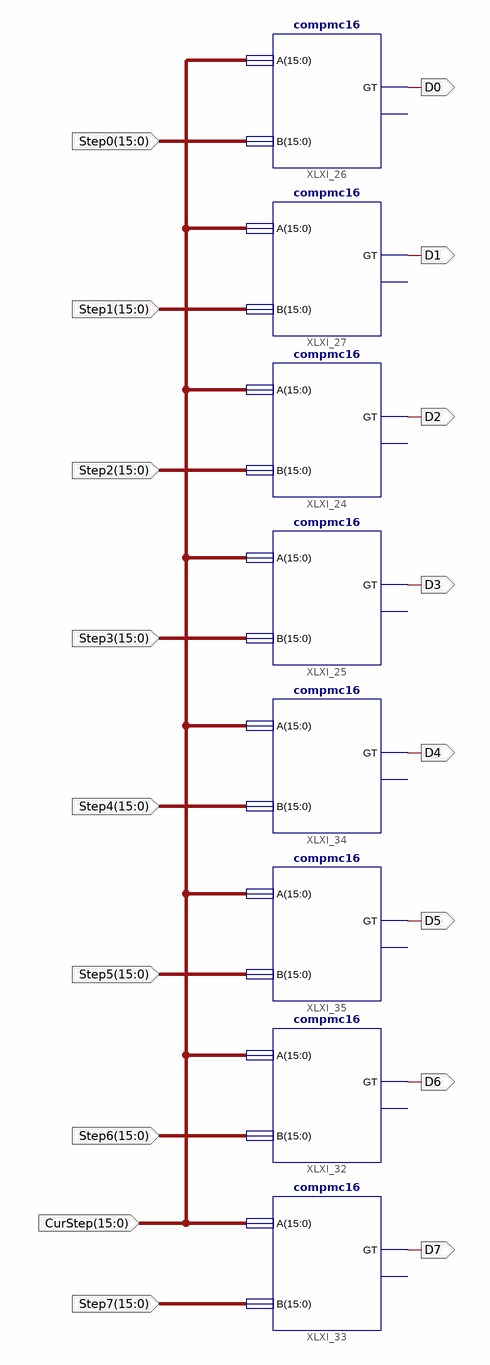
[diagram p0: schematic sheet 1]
// Xilinx ISE schematic Compare_x8.sch (spartan6) as structural Verilog: 8 symbols, 17 ports
module Compare_x8 (
  input  [15:0] CurStep,
  input  [15:0] Step0,
  input  [15:0] Step1,
  input  [15:0] Step2,
  input  [15:0] Step3,
  input  [15:0] Step4,
  input  [15:0] Step5,
  input  [15:0] Step6,
  input  [15:0] Step7,
  output D0,
  output D1,
  output D2,
  output D3,
  output D4,
  output D5,
  output D6,
  output D7
);

  compmc16 XLXI_35 (.A(CurStep), .B(Step5), .GT(D5));  // open: LT
  compmc16 XLXI_33 (.A(CurStep), .B(Step7), .GT(D7));  // open: LT
  compmc16 XLXI_32 (.A(CurStep), .B(Step6), .GT(D6));  // open: LT
  compmc16 XLXI_34 (.A(CurStep), .B(Step4), .GT(D4));  // open: LT
  compmc16 XLXI_25 (.A(CurStep), .B(Step3), .GT(D3));  // open: LT
  compmc16 XLXI_24 (.A(CurStep), .B(Step2), .GT(D2));  // open: LT
  compmc16 XLXI_27 (.A(CurStep), .B(Step1), .GT(D1));  // open: LT
  compmc16 XLXI_26 (.A(CurStep), .B(Step0), .GT(D0));  // open: LT
endmodule
